# EAGLE design power_distribution (EAGLE 7.2.0)
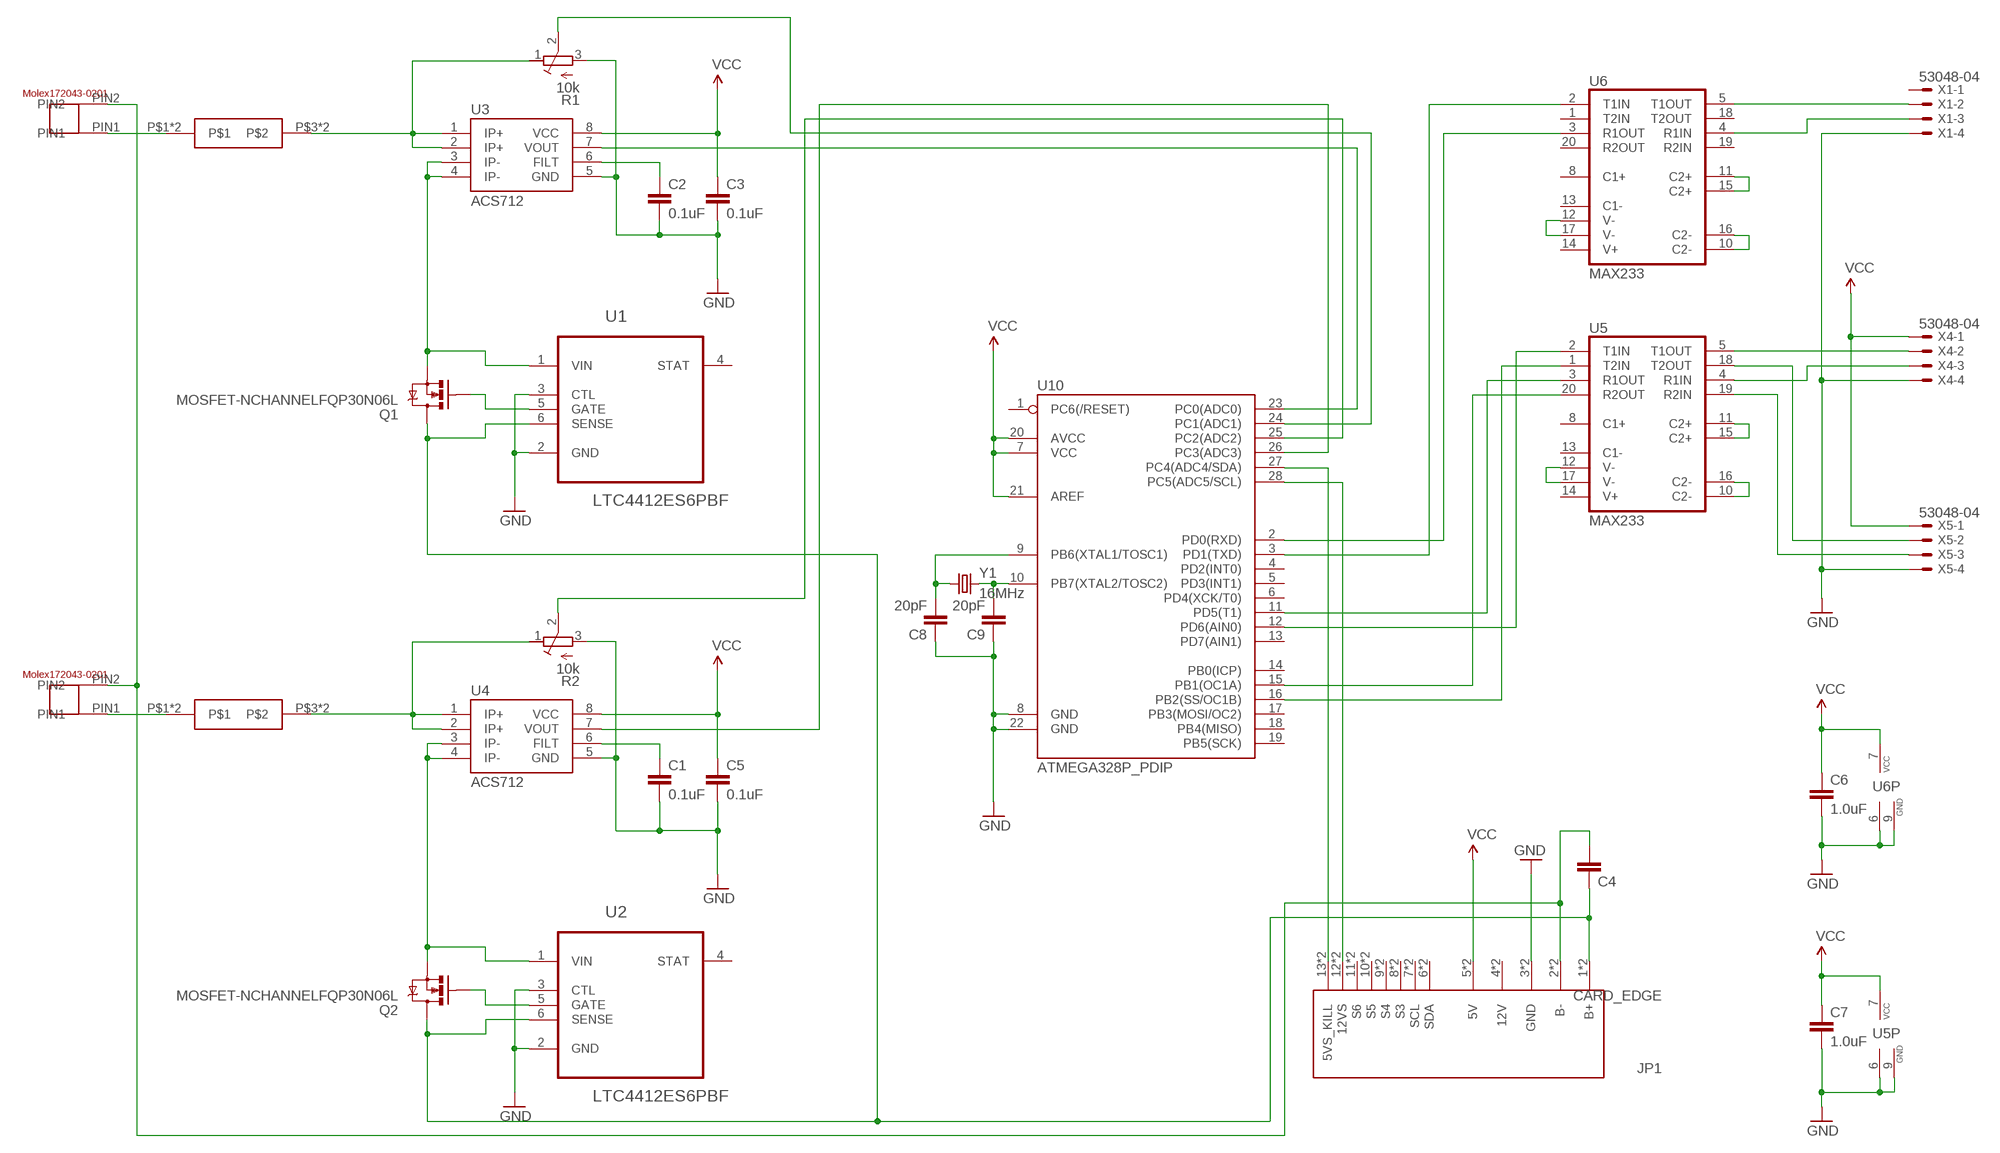
[diagram p0: schematic, sheet 1]

## Parts
C1  0.1uF  CAPEZ  [CAP-PTH-SMALLEZ]
C2  0.1uF  CAPEZ  [CAP-PTH-SMALLEZ]
C3  0.1uF  CAPEZ  [CAP-PTH-SMALLEZ]
C4  CAPEZ  [CAP-PTH-SMALLEZ]
C5  0.1uF  CAPEZ  [CAP-PTH-SMALLEZ]
C6  1.0uF  CAPEZ  [CAP-PTH-SMALLEZ]
C7  1.0uF  CAPEZ  [CAP-PTH-SMALLEZ]
C8  20pF  CAPEZ  [CAP-PTH-SMALLEZ]
C9  20pF  CAPEZ  [CAP-PTH-SMALLEZ]
F1  FUSE-HOLDER  [FUSE_HOLDER]
F2  FUSE-HOLDER  [FUSE_HOLDER]
JP1  CARD_EDGE  [EDGE_CONNECTOR]
Q1  MOSFET-NCHANNELFQP30N06L  [TO220V]
Q2  MOSFET-NCHANNELFQP30N06L  [TO220V]
R1  10k  R-TRIMM43P  [RTRIM43P]
R2  10k  R-TRIMM43P  [RTRIM43P]
U1  LTC4412ES6PBF  [SOT95P280X100-6N]
U2  LTC4412ES6PBF  [SOT95P280X100-6N]
U3  ACS712  [SO08]
U4  ACS712  [SO08]
U5  MAX233  [DIL20]
U6  MAX233  [DIL20]
U10  ATMEGA328P_PDIP  [DIL28-3]
U$1  MOLEX172043-0201  [MOLEX172043-0201]
U$2  MOLEX172043-0201  [MOLEX172043-0201]
X1  53048-04  [53048-04]
X4  53048-04  [53048-04]
X5  53048-04  [53048-04]
Y1  16MHz  CRYSTALHC49U-V  [HC49U-V]

## Nets
B1+: F1.P$1 F1.P$2 U$1.PIN1
B1F+: F1.P$3 F1.P$4 R1.1(A) U3.1(IP+) U3.2(IP+)
B1RX232: U5.4(R1IN) X4.3
B1TX232: U5.5(T1OUT) X4.2
B2+: F2.P$1 F2.P$2 U$2.PIN1
B2F+: F2.P$3 F2.P$4 R2.1(A) U4.1(IP+) U4.2(IP+)
B2RX232: U5.19(R2IN) X5.3
B2TX232: U5.18(T2OUT) X5.2
B+: C4.1 JP1.1(B+) JP1.14(B+) Q1.2(D) Q2.2(D) U1.6(SENSE) U2.6(SENSE)
B-: C4.2 JP1.2(B-) JP1.15(B-) U$1.PIN2 U$2.PIN2
C2+B: U5.11(C2+) U5.15(C2+)
C2+CPU: U6.11(C2+) U6.15(C2+)
C2-B: U5.10(C2-) U5.16(C2-)
C2-CPU: U6.10(C2-) U6.16(C2-)
CPU232RX: U6.4(R1IN) X1.3
CPU232TX: U6.5(T1OUT) X1.2
FILT1: C2.1 U3.6(FILT)
FILT2: C1.1 U4.6(FILT)
GATE1: Q1.1(G) U1.5(GATE)
GATE2: Q2.1(G) U2.5(GATE)
GND: C1.2 C2.2 C3.2 C5.2 C6.2 C7.2 C8.1 C9.1 JP1.3(GND) JP1.16(GND) R1.3(E) R2.3(E) U1.2(GND) U1.3(CTL) U2.2(GND) U2.3(CTL) U3.5(GND) U4.5(GND) U5.6(GND) U5.9(GND) U6.6(GND) U6.9(GND) U10.8(GND) U10.22(GND) X1.4 X4.4 X5.4
RX1SOFT: U5.3(R1OUT) U10.11(PD5(T1))
RX2SOFT: U5.20(R2OUT) U10.15(PB1(OC1A))
RXD: U6.3(R1OUT) U10.2(PD0(RXD))
SCL: JP1.12(12VS) JP1.25(12VS) U10.28(PC5(ADC5/SCL))
SDA: JP1.13(5VS_KILL) JP1.26(5VS_KILL) U10.27(PC4(ADC4/SDA))
TX1SOFT: U5.2(T1IN) U10.12(PD6(AIN0))
TX2SOFT: U5.1(T2IN) U10.16(PB2(SS/OC1B))
TXD: U6.2(T1IN) U10.3(PD1(TXD))
V-B: U5.12(V-) U5.17(V-)
V-CPU: U6.12(V-) U6.17(V-)
VCC: C3.1 C5.1 C6.1 C7.1 JP1.5(5V) JP1.18(5V) U3.8(VCC) U4.8(VCC) U5.7(VCC) U6.7(VCC) U10.7(VCC) U10.20(AVCC) U10.21(AREF) X4.1 X5.1
VDIV1: R1.2(S) U10.24(PC1(ADC1))
VDIV2: R2.2(S) U10.25(PC2(ADC2))
VIN1: Q1.3(S) U1.1(VIN) U3.3(IP-) U3.4(IP-)
VIN2: Q2.3(S) U2.1(VIN) U4.3(IP-) U4.4(IP-)
VOUT1: U3.7(VOUT) U10.23(PC0(ADC0))
VOUT2: U4.7(VOUT) U10.26(PC3(ADC3))
XOSC1: C8.2 U10.9(PB6(XTAL1/TOSC1)) Y1.1
XOSC2: C9.2 U10.10(PB7(XTAL2/TOSC2)) Y1.2
Unconnected: JP1.4(12V) JP1.6(SDA) JP1.7(SCL) JP1.8(S3) JP1.9(S4) JP1.10(S5) JP1.11(S6) JP1.17(12V) JP1.19(SDA) JP1.20(SCL) JP1.21(S3) JP1.22(S4) JP1.23(S5) JP1.24(S6) U1.4(STAT) U2.4(STAT) U5.8(C1+) U5.13(C1-) U5.14(V+) U6.1(T2IN) U6.8(C1+) U6.13(C1-) U6.14(V+) U6.18(T2OUT) U6.19(R2IN) U6.20(R2OUT) U10.1(PC6(/RESET)) U10.4(PD2(INT0)) U10.5(PD3(INT1)) U10.6(PD4(XCK/T0)) U10.13(PD7(AIN1)) U10.14(PB0(ICP)) U10.17(PB3(MOSI/OC2)) U10.18(PB4(MISO)) U10.19(PB5(SCK)) X1.1

## Library data of the parts
C1-C9 = SparkFun-Capacitors:CAP: Capacitor Standard 0603 ceramic capacitor, and 0.1" leaded capacitor.
F1 F2 = fuse-holder:FUSE-HOLDER
JP1 = Molex_Edge_2:CARD_EDGE
Q1 Q2 = SparkFun-DiscreteSemi:MOSFET-NCHANNEL: Common NMOSFET Parts MFG P/N Store ID Prod ID FDD8780 TRANS-09984 SI7820DN TRANS-11055 FDS6630A IC-08089 2N7002PW TRANS-11151 FQP30N06L COM-10213 TRANS-10060 BSS123LT1G TRANS-08345 BSS138 TRANS-00830 BS170 2N7000; PROD_ID: TRANS-10060
R1 R2 = resistor:R-TRIMM: Trimm resistor
U1 U2 = LTC_By_element14_Batch_1:LTC4412ES6PBF: Low Loss PowerPath Controller; MPN: LTC4412ES6#PBF; OC_FARNELL: 1531480; OC_NEWARK: 61M3335; PACKAGE: TSOT-23-6; SUPPLIER: Linear Technology
U3 U4 = SparkFun-AnalogIC:ACS712: Hall-effect-based isolated linear current sensor
U5 U6 = maxim:MAX233: RS232 TRANSCEIVER; MPN: MAX233ACPP+G36; OC_FARNELL: 1593332; OC_NEWARK: 89K3459
U10 = SparkFun-DigitalIC:ATMEGA328P_PDIP: uC used in the Arduino 32kb flash, 1k EEPROM, 2k SRAM This is the through-hole version of this chip.
U$1 U$2 = Molex172043-0201:MOLEX172043-0201
X1 X4 X5 = con-molex:53?-04: CONNECTOR wire to board 1.25 mm (.049 inch) pitch header; MF: MOLEX; MPN: 53048-0410; OC_FARNELL: 1462887; OC_NEWARK: 57H4721
Y1 = crystal:CRYSTAL: CRYSTAL; OC_FARNELL: 1666969; OC_NEWARK: unknown

## Board
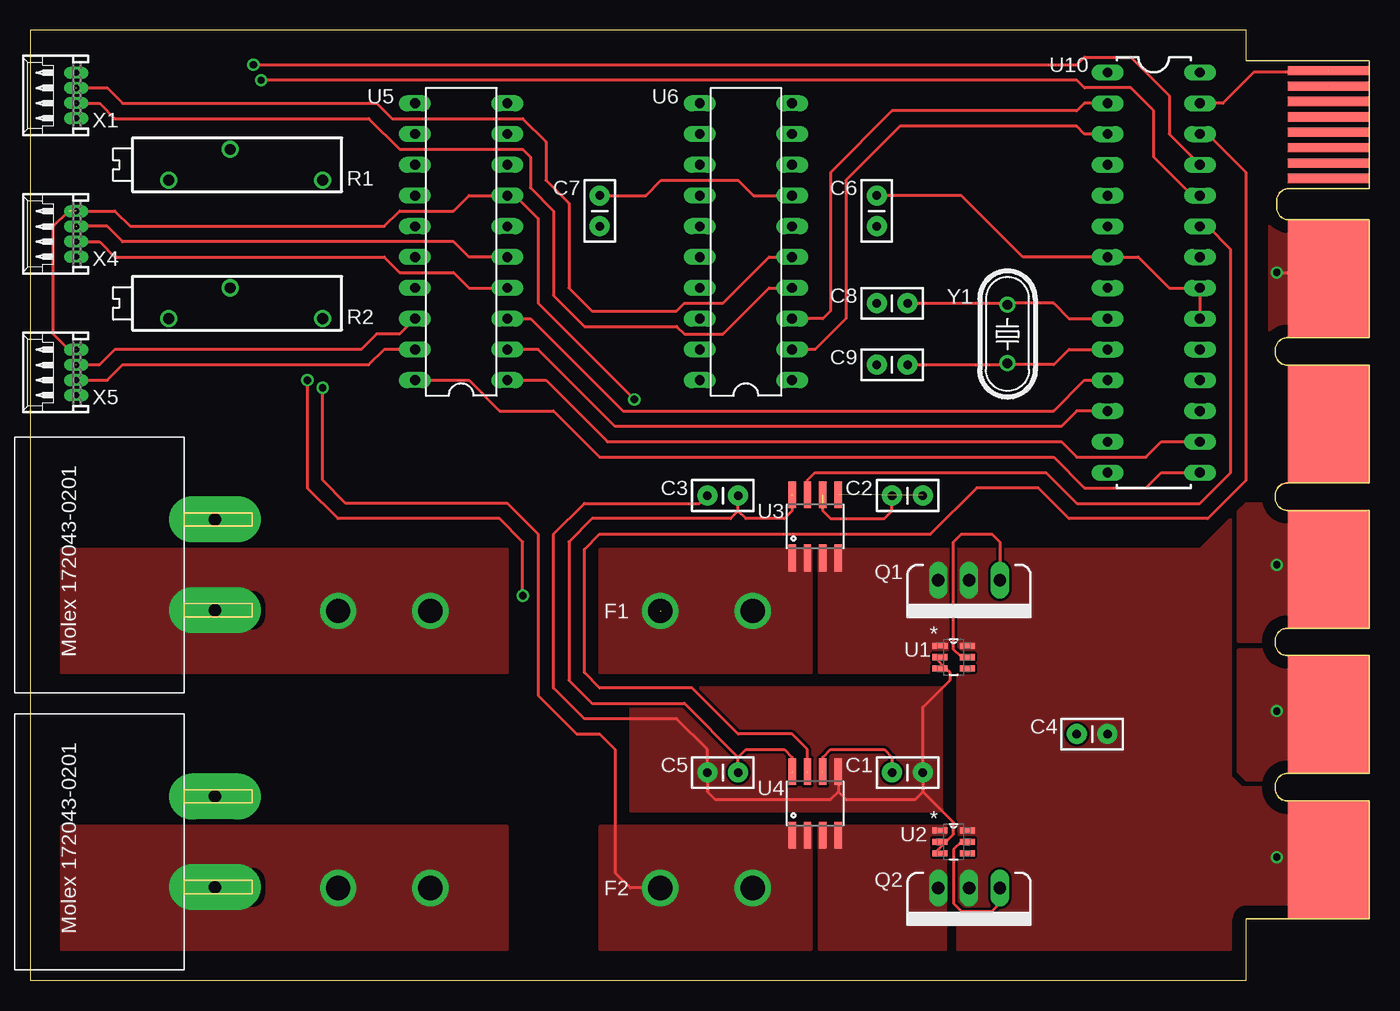
[diagram p1: board, top side]
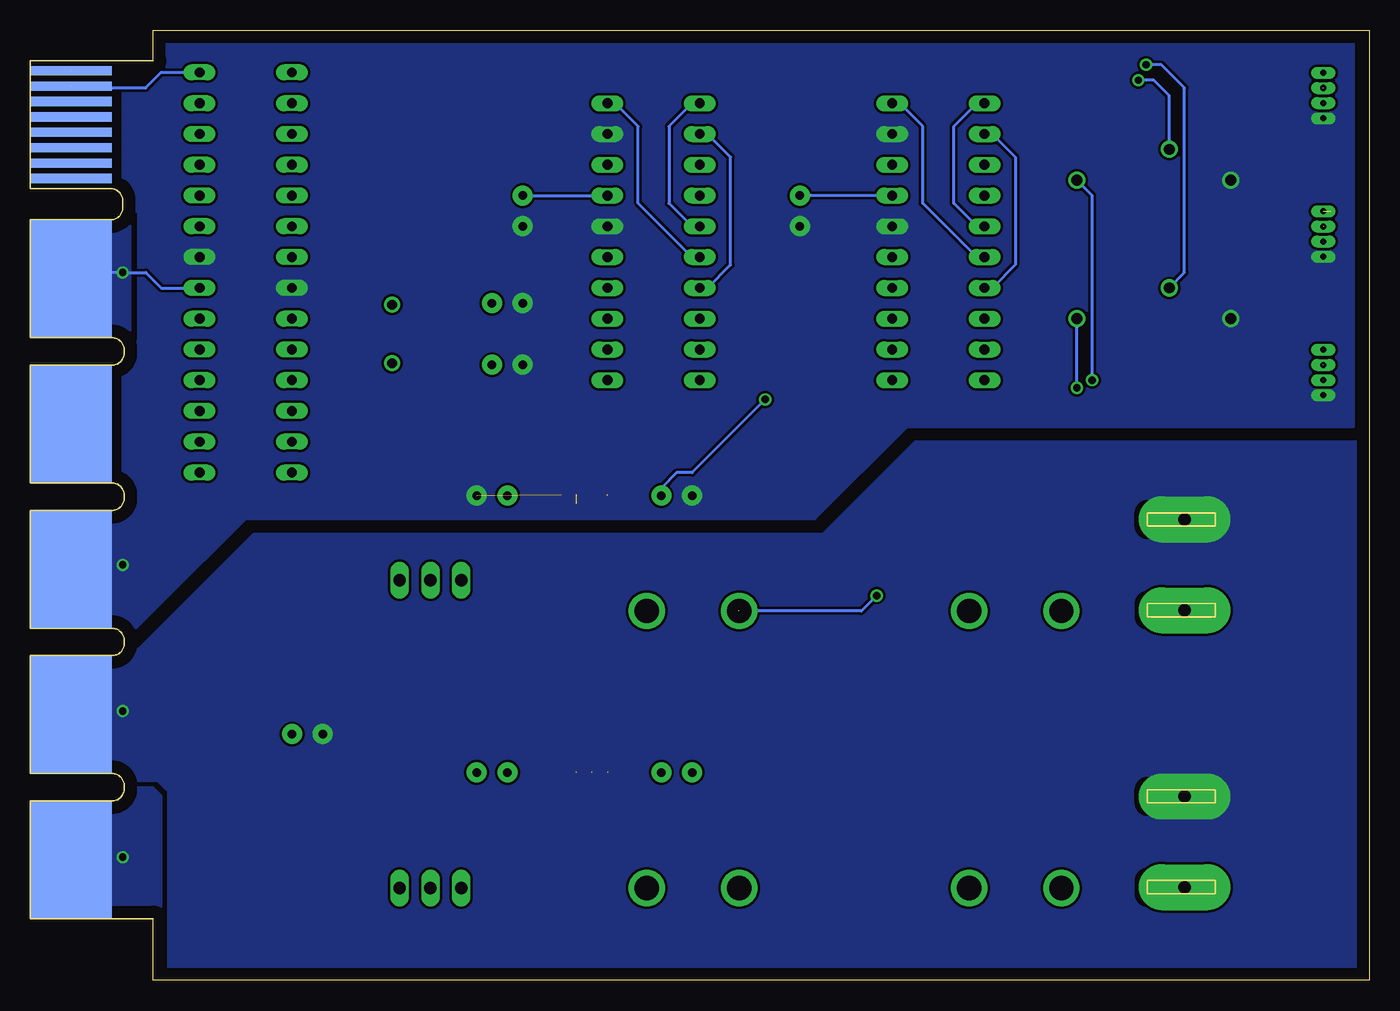
[diagram p2: board, bottom side, seen from below]

Size 110.49 x 78.41 mm. Coordinates in mm from the lower left corner, seen from the top.
Outline: 100.33,5.08 100.33,0 0,0 0,78.41 100.33,78.41 100.33,75.95
Copper layers (1*16): Top 0.035mm / dielectric 1.5mm / Bottom 0.035mm
Design rules "default *": minimum track width 10mil, minimum drill 24mil, track to track 8mil, track to pad 8mil, pad to pad 8mil, via to via 8mil, smd to smd 8mil, copper to edge 40mil, drill to drill 8mil, minimum pad ring 10mil, minimum via ring 8mil, stop-mask expansion 4mil, vias tented up to drill 0mil, thermal gap 10mil

### Footprints (pad centres in the part's own frame; a part is rotated, then mirrored left to right if it is on the bottom)
CAP-PTH-SMALLEZ = drill 0.7 pad 1.651: 1 0,0; 2 2.54,0
FUSE_HOLDER = drill 2: P$1 0,0; P$2 7.62,0; P$3 34.214,0; P$4 26.594,0
EDGE_CONNECTOR = smd 9.73 x 6.7 bottom: 1 4.87,3.35 | smd 9.728 x 6.706 bottom: 2 16.87,3.35; 3 28.87,3.35; 4 40.87,3.35; 5 52.87,3.35 | smd 0.76 x 6.7 bottom: 6 61.1,3.35; 7 62.37,3.35; 8 63.64,3.35; 9 64.91,3.35; 10 66.18,3.35; 11 67.45,3.35; 12 68.72,3.35; 13 69.99,3.35 | smd 9.73 x 6.7: 14 4.87,3.35 | smd 9.728 x 6.706: 15 16.87,3.35; 16 28.87,3.35; 17 40.87,3.35; 18 52.87,3.35 | smd 0.76 x 6.7: 19 61.1,3.35; 20 62.37,3.35; 21 63.64,3.35; 22 64.91,3.35; 23 66.18,3.35; 24 67.45,3.35; 25 68.72,3.35; 26 69.99,3.35
TO220V = drill 1.016 long: 1 -2.54,0; 2 0,0; 3 2.54,0
RTRIM43P = drill 0.9: 1 -7.62,1.27; 2 0,-1.27; 3 5.08,1.27
SOT95P280X100-6N = smd 1.219 x 0.508: 1 -1.143,0.94; 2 -1.143,0; 3 -1.143,-0.94; 4 1.143,-0.94; 5 1.143,0; 6 1.143,0.94
SO08 = smd 0.61 x 2.21: 1 -1.905,-2.616; 2 -0.635,-2.616; 3 0.635,-2.616; 4 1.905,-2.616; 5 1.905,2.616; 6 0.635,2.616; 7 -0.635,2.616; 8 -1.905,2.616
DIL20 = drill 0.813 long: 1 -11.43,-3.81; 2 -8.89,-3.81; 3 -6.35,-3.81; 4 -3.81,-3.81; 5 -1.27,-3.81; 6 1.27,-3.81; 7 3.81,-3.81; 8 6.35,-3.81; 9 8.89,-3.81; 10 11.43,-3.81; 11 11.43,3.81; 12 8.89,3.81; 13 6.35,3.81; 14 3.81,3.81; 15 1.27,3.81; 16 -1.27,3.81; 17 -3.81,3.81; 18 -6.35,3.81; 19 -8.89,3.81; 20 -11.43,3.81
DIL28-3 = drill 0.813 long: 1 -16.51,-3.81; 2 -13.97,-3.81; 3 -11.43,-3.81; 4 -8.89,-3.81; 5 -6.35,-3.81; 6 -3.81,-3.81; 7 -1.27,-3.81; 8 1.27,-3.81; 9 3.81,-3.81; 10 6.35,-3.81; 11 8.89,-3.81; 12 11.43,-3.81; 13 13.97,-3.81; 14 16.51,-3.81; 15 16.51,3.81; 16 13.97,3.81; 17 11.43,3.81; 18 8.89,3.81; 19 6.35,3.81; 20 3.81,3.81; 21 1.27,3.81; 22 -1.27,3.81; 23 -3.81,3.81; 24 -6.35,3.81; 25 -8.89,3.81; 26 -11.43,3.81; 27 -13.97,3.81; 28 -16.51,3.81
MOLEX172043-0201 = drill 1 pad 3.81 long: PIN1 -3.747,-2.54; PIN2 3.747,-2.54
53048-04 = drill 0.5 pad 0.698 long: 1 1.875,-1.25; 2 0.625,-1.25; 3 -0.625,-1.25; 4 -1.875,-1.25
HC49U-V = drill 0.813: 1 -2.413,0; 2 2.413,0

### Placement (x,y rotation side)
C1  71.12,17.14 0 top
C2  71.12,40.01 0 top
C3  58.42,40.01 180 top
C4  88.9,20.32 180 top
C5  58.42,17.14 180 top
C6  69.85,64.77 270 top
C7  46.99,64.77 270 top
C8  69.85,55.88 0 top
C9  69.85,50.8 0 top
F1  25.4,30.48 0 top
F2  25.4,7.62 0 top
JP1  110.49,5.08 90 top
Q1  77.47,33.02 180 top
Q2  77.47,7.62 180 top
R1  16.51,67.31 180 top
R2  16.51,55.88 180 top
U1  76.2,26.67 0 top
U2  76.2,11.43 0 top
U3  64.77,37.47 0 top
U4  64.77,14.61 0 top
U5  35.56,60.96 90 top
U6  59.05,60.96 90 top
U10  92.71,58.42 270 top
U$1  12.7,34.29 90 top
U$2  12.7,11.43 90 top
X1  2.54,73.03 90 top
X4  2.54,61.59 90 top
X5  2.54,50.16 90 top
Y1  80.64,53.34 270 top

### Tracks (layer width: path | path; a pad name or v marks a point on that pad's centre or on a via)
B1+
  pour Top (no thermals): 2.54,25.4 39.37,25.4 39.37,35.56 2.54,35.56
B1F+  (via drill 0.6)  (1 unrouted)
  Top 0.254: v40.64,31.75 40.64,36.2 38.73,38.1 25.4,38.1 22.86,40.64 v22.86,49.53
  Bottom 0.254: v22.86,49.53 22.86,64.77 R1.1 | 52.07,30.48 41.91,30.48 v40.64,31.75
  pour Top (no thermals): 64.45,25.4 64.45,35.56 46.99,35.56 46.99,25.4
B1RX232  (1 unrouted)
  Top 0.254: 3.81,60.96 5.71,60.96 6.99,59.69 29.21,59.69 30.48,58.42 34.92,58.42 36.2,57.15 U5.4
B1TX232  (1 unrouted)
  Top 0.254: U5.5 36.2,59.69 34.92,60.96 7.62,60.96 6.35,62.23 3.81,62.23
B2+
  pour Top (no thermals): 2.54,12.7 2.54,2.54 39.37,2.54 39.37,12.7
B2F+  (via drill 0.6)
  Top 0.254: v24.13,48.9 24.13,41.27 26.04,39.37 39.37,39.37 41.91,36.83 41.91,23.5 45.09,20.32 46.99,20.32 48.26,19.05 48.26,8.89 49.53,7.62 52.07,7.62
  Bottom 0.254: v24.13,48.9 R2.1
  pour Top (no thermals): 64.45,2.54 64.45,12.7 46.99,12.7 46.99,2.54
B2RX232  (1 unrouted)
  Top 0.254: U5.19 29.21,52.07 27.94,50.8 7.62,50.8 6.35,49.53 3.81,49.53
B2TX232  (1 unrouted)
  Top 0.254: U5.18 30.48,53.34 28.57,53.34 27.3,52.07 6.99,52.07 5.71,50.8 3.81,50.8
B+  (via drill 0.6)
  Bottom 0.254: JP1.14 104.56,9.95 104.46,9.84
  other vias: 102.87,10.16
  pour Top (no thermals): 76.52,35.56 76.52,2.54 99.06,2.54 99.06,38.1 96.52,35.56
  pour Top (no thermals): 110.49,15.88 100.01,15.88 98.42,17.46 98.42,4.45 99.69,5.71 110.49,5.71
  pour Bottom (no thermals): 110.49,5.71 100.33,5.71 99.69,5.08 99.69,15.24 100.33,15.88 110.49,15.88
B-  (via drill 0.6)
  other vias: 102.87,22.23
  pour Bottom (no thermals): 98.42,30.48 101.6,27.3 110.49,27.3 110.49,16.51 100.01,16.51 98.42,14.92
  pour Bottom (no thermals): 45.09,36.83 37.47,44.45 0.64,44.45 0.64,0.64 99.06,0.64 99.06,29.84 92.08,36.83
  pour Top (no thermals): 110.49,27.3 110.49,16.51 100.33,16.51 99.69,17.14 99.69,27.3
C2+B
  Bottom 0.254: U5.15 32.38,62.23 34.29,64.14 34.29,70.48 32.38,72.39 U5.11
C2+CPU
  Bottom 0.254: U6.11 55.88,72.39 57.78,70.48 57.78,64.14 55.88,62.23 U6.15
C2-B
  Bottom 0.254: U5.16 32.38,59.69 36.83,64.14 36.83,70.48 38.73,72.39 U5.10
C2-CPU
  Bottom 0.254: U6.16 55.88,59.69 60.33,64.14 60.33,70.48 62.23,72.39 U6.10
CPU232RX  (1 unrouted)
  Top 0.254: 3.81,72.39 5.71,72.39 6.99,71.12 27.94,71.12 30.48,68.58 40.64,68.58 41.27,67.94 41.27,65.41 43.18,63.5 43.18,56.52 45.72,53.98 53.34,53.98 53.98,53.34 57.15,53.34 60.96,57.15 U6.4
CPU232TX  (1 unrouted)
  Top 0.254: 3.81,73.66 6.35,73.66 7.62,72.39 28.57,72.39 29.84,71.12 40.64,71.12 42.55,69.22 42.55,66.04 44.45,64.14 44.45,57.15 46.35,55.24 53.34,55.24 53.98,55.88 57.15,55.88 60.96,59.69 U6.5
FILT1  (1 unrouted)
  Top 0.254: C2.1 71.12,38.73 70.48,38.1 66.04,38.1 65.41,38.73 65.41,39.37
FILT2  (1 unrouted)
  Top 0.254: 65.41,17.14 65.41,18.41 66.04,19.05 70.48,19.05 71.12,18.41 C1.1
GATE1
  Top 0.254: Q1.1 80.01,36.2 79.38,36.83 76.83,36.83 76.2,36.2 76.2,27.3 76.83,26.67 U1.5
GATE2
  Top 0.254: Q2.1 80.01,6.35 79.38,5.71 76.83,5.71 76.2,6.35 76.2,10.79 76.83,11.43 U2.5
GND  (via drill 0.6)  (1 unrouted)
  Top 0.254: 73.66,15.56 76.2,13.02 76.2,12.06 75.41,11.27 | 75.41,11.27 74.61,10.48 75.04,10.48 U2.3 | 73.66,15.56 73.03,14.92 67.31,14.92 66.67,15.56 | 73.66,15.56 C1.2 73.66,22.54 75.88,24.77 75.88,25.4 75.56,25.72 | C3.2 55.24,39.37 45.72,39.37 43.18,36.83 43.18,24.13 45.72,21.59 53.34,21.59 55.88,19.05 C5.2 55.88,15.56 56.52,14.92 66.04,14.92 66.67,15.56 | 66.67,16.51 66.67,15.56 | 74.93,25.72 75.04,25.72 U1.3 75.07,25.72 75.56,25.72 | U2.2 75.25,11.43 75.41,11.27 | 75.25,26.67 U1.2 74.61,26.67 75.56,25.72
  other vias: 102.87,34.29
  pour Bottom (no thermals): 1.27,77.47 102.87,77.47 102.87,63.5 101.6,63.5 101.6,52.7 102.87,52.7 102.87,38.1 45.72,38.1 38.1,45.72 1.27,45.72
  pour Bottom (no thermals): 110.49,39.37 110.49,28.57 102.23,28.57 90.17,40.64 100.97,40.64 102.23,39.37
  pour Top (no thermals): 49.53,22.54 49.53,13.97 75.25,13.97 75.25,24.13 55.24,24.13 58.74,20.64 63.18,20.64 64.45,19.37 64.45,15.88 62.55,15.88 62.55,18.73 57.47,18.73 53.66,22.54
  pour Top (no thermals): 110.49,27.94 99.69,27.94 99.69,38.73 100.33,39.37 110.49,39.37
RX1SOFT
  Top 0.254: U5.3 41.27,54.61 48.9,46.99 84.45,46.99 87,49.53 U10.11
RX2SOFT
  Top 0.254: U5.20 36.2,49.53 38.73,46.99 43.18,46.99 46.99,43.18 84.45,43.18 87,40.64 92.08,40.64 93.34,41.91 U10.15
RXD
  Top 0.254: U10.2 87,72.39 86.36,71.75 71.12,71.75 66.04,66.67 66.04,55.24 65.41,54.61 U6.3
SCL  (1 unrouted)
  Bottom 0.254: U10.28 99.69,74.93 100.97,73.66 104.14,73.66 104.28,73.8 JP1.12
SDA  (1 unrouted)
  Top 0.254: U10.27 98.42,72.39 100.97,74.93 104.14,74.93 104.28,75.07 JP1.13
TX1SOFT
  Top 0.254: U10.12 86.36,46.99 85.09,45.72 48.26,45.72 41.91,52.07 U5.2
TX2SOFT
  Top 0.254: U5.1 42.55,49.53 47.62,44.45 85.09,44.45 86.36,43.18 92.08,43.18 93.34,44.45 U10.16
TXD
  Top 0.254: U10.3 87,69.85 86.36,70.48 71.75,70.48 67.31,66.04 67.31,54.61 64.77,52.07 U6.2
V-B
  Bottom 0.254: U5.12 31.11,69.85 29.21,67.94 29.21,59.05 31.11,57.15 U5.17
V-CPU
  Bottom 0.254: U6.17 54.61,57.15 52.7,59.05 52.7,67.94 54.61,69.85 U6.12
VCC  (via drill 0.6)  (4 unrouted)
  Top 0.254: U10.20 U10.21 93.98,57.15 91.44,59.69 U10.7 81.92,59.69 76.83,64.77 C6.1 | JP1.18 105.88,57.95 105.41,58.42 v102.87,58.42 | 3.81,52.07 3.17,52.07 1.91,53.34 1.91,62.23 3.17,63.5 6.99,63.5 8.26,62.23 29.21,62.23 30.48,63.5 34.92,63.5 36.2,64.77 U5.7 40.01,64.77 41.91,62.87 41.91,55.88 v49.85,47.94 | 62.87,40.01 62.87,38.73 62.23,38.1 59.05,38.1 58.42,38.73 | 58.42,38.73 C3.1 | 58.42,38.73 57.78,38.1 46.35,38.1 44.45,36.2 44.45,24.77 46.35,22.86 53.98,22.86 58.42,18.41 | C5.1 58.42,18.41 | 58.42,18.41 59.05,19.05 62.23,19.05 62.87,18.41 62.87,17.14 | C7.1 50.8,64.77 52.07,66.04 58.42,66.04 59.69,64.77 U6.7
  Bottom 0.254: 106.05,58.42 107.31,57.78 104.78,57.78 104.61,57.95 | C6.1 U6.7 | U5.7 C7.1 | JP1.18 104.61,57.95 | 104.61,57.95 104.14,58.42 v102.87,58.42 100.97,58.42 99.69,57.15 U10.21 | v49.85,47.94 55.88,41.91 57.15,41.91 58.42,40.64 C3.1
  pour Top (no thermals): 104.78,63.5 102.23,63.5 102.23,52.07 104.78,52.07
  pour Bottom (no thermals): 102.23,62.87 104.78,62.87 104.78,53.34 102.23,53.34
VDIV1  (via drill 0.6)
  Top 0.254: v19.05,74.3 86.36,74.3 87,73.66 90.81,73.66 92.71,71.75 92.71,67.94 95.89,64.77 U10.24
  Bottom 0.254: R1.2 16.51,73.03 17.78,74.3 v19.05,74.3
VDIV2  (via drill 0.6)
  Top 0.254: v18.41,75.56 86.36,75.56 87,76.2 90.81,76.2 93.98,73.03 93.98,69.85 U10.25
  Bottom 0.254: R2.2 15.24,58.42 15.24,73.66 17.14,75.56 v18.41,75.56
VIN1
  pour Top (no thermals): 65.09,25.4 75.88,25.4 75.88,35.56 65.09,35.56
VIN2
  pour Top (no thermals): 65.09,2.54 75.56,2.54 75.56,12.7 65.09,12.7
VOUT1
  Top 0.254: U3.7 64.14,41.27 64.77,41.91 83.82,41.91 86.36,39.37 96.52,39.37 99.06,41.91 99.06,60.33 97.16,62.23 U10.23
VOUT2  (1 unrouted)
  Top 0.254: 64.14,17.14 64.14,19.05 62.87,20.32 58.42,20.32 54.61,24.13 46.99,24.13 45.72,25.4 45.72,35.56 46.99,36.83 74.3,36.83 78.11,40.64 83.19,40.64 85.72,38.1 97.16,38.1 100.33,41.27 100.33,66.67 97.16,69.85 U10.26
XOSC1
  Top 0.254: C8.2 80.77,55.88 | U10.9 85.72,54.61 84.45,55.88 80.77,55.88 | 80.77,55.88 Y1.1
XOSC2
  Top 0.254: C9.2 80.77,50.8 | U10.10 85.72,52.07 84.45,50.8 80.77,50.8 | 80.77,50.8 Y1.2

### Text on the board
tPlace: F1 | F2